# Altium schematic sheet LCDTFT_FPC40P_RGB_FULL.SchDoc: =DocumentName
size A3; DocumentNumber: 11; SheetNumber: 6; SheetTotal: 8
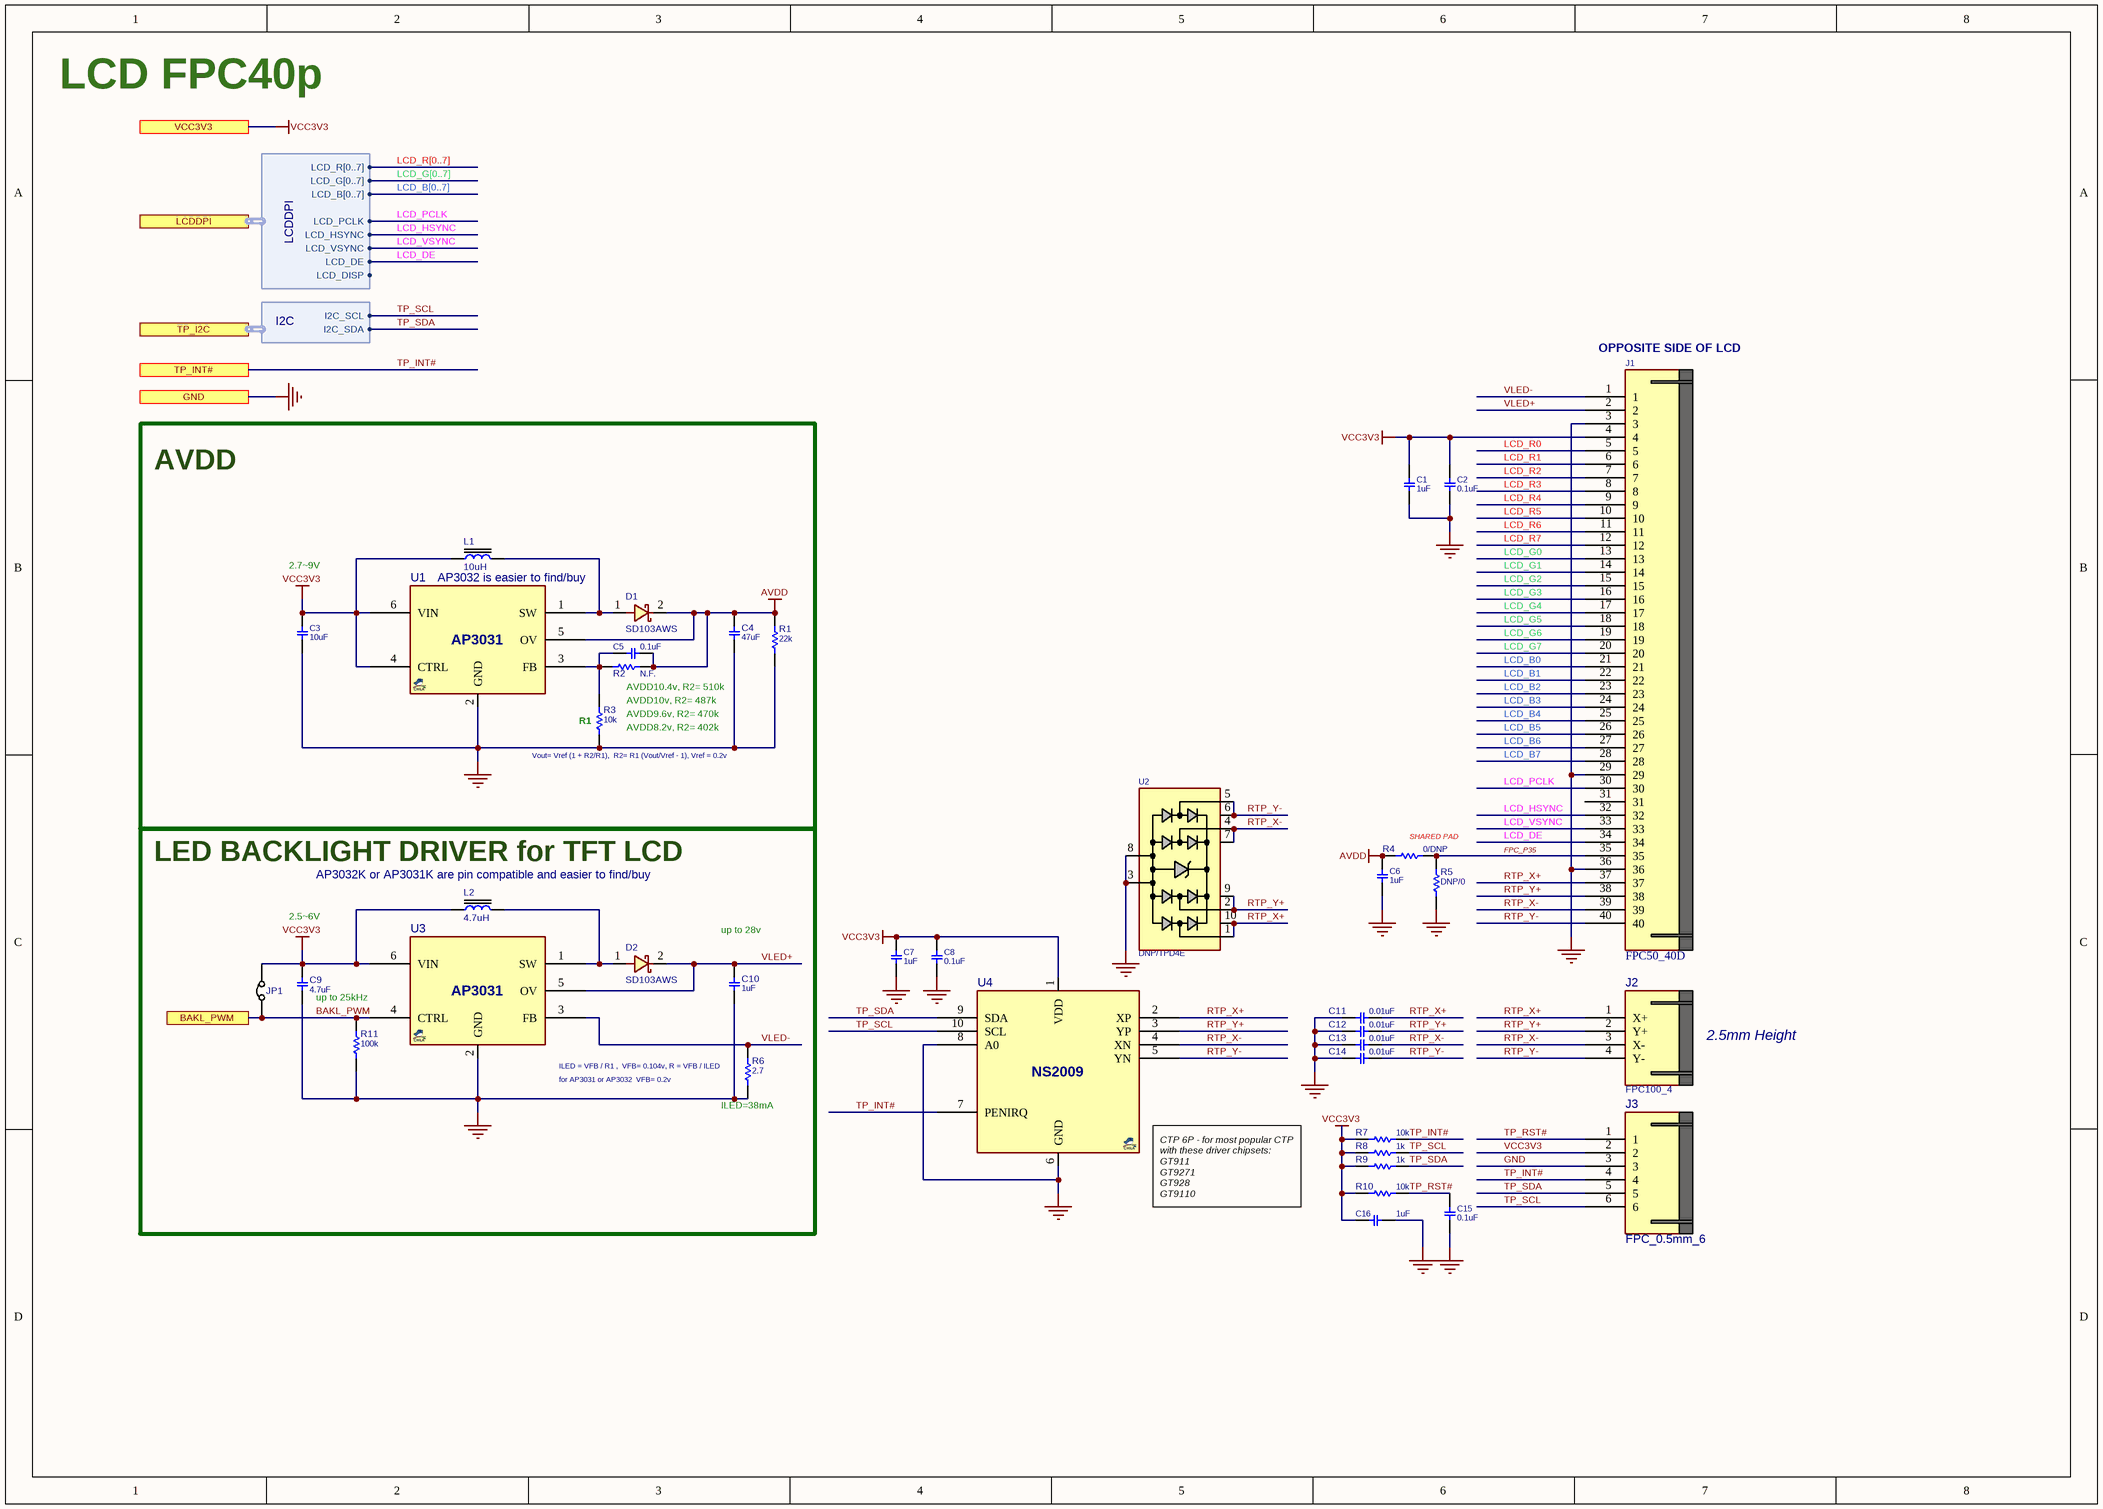
[diagram p0: LCDTFT_FPC40P_RGB_FULL.SchDoc]

## Parts
C1  1uF  [C0402]
C2  0.1uF  [C0402]
C3  10uF  [C0402]
C4  47uF  [C1206]
C5  0.1uF  [C0402]
C6  1uF  [C0402]
C7  1uF  [C0402]
C8  0.1uF  [C0402]
C9  4.7uF  [C0402]
C10  1uF  [C0603]
C11  0.01uF  [C0402]
C12  0.01uF  [C0402]
C13  0.01uF  [C0402]
C14  0.01uF  [C0402]
C15  0.1uF  [C0402]
C16  1uF  [C0402]
D1  SD103AWS  [D_SOD323]
D2  SD103AWS  [D_SOD323]
J1  FPC50_40D  [FPC50_40D_FFC2B29]
J2  FPC100_4  [FPC100_4HT]
J3  FPC_0.5mm_6  [FPC50_6]
JP1  JMPSOLDER  [JP_60X100]  (value not drawn)  (no BOM)
L1  10uH  [L_4]
L2  4.7uH  [L1008]
R1  22k  [R0402]
R2  N.F.  [R0402]
R3  10k  [R0402]
R4  0/DNP  [R0402]
R5  DNP/0  [R0402]
R6  2.7  [R0402]
R7  10k  [R0402]
R8  1k  [R0402]
R9  1k  [R0402]
R10  10k  [R0402]
R11  100k  [R0402]
U1  AP3031  [SOT23_6]  (value not drawn)
U2  DNP/TPD4E  [SON50_10_2510E]
U3  AP3031  [SOT23_6]  (value not drawn)
U4  NS2009  [SOG50_10]  (value not drawn)

## Blocks framed on the sheet
AVDD: C3-C5 D1 L1 R1-R3 U1
LED BACKLIGHT DRIVER for TFT LCD: C9 C10 D2 JP1 L2 R6 R11 U3

## Ports
BAKL_PWM, GND, LCDDPI (harness LCDDPI), TP_I2C (harness I2C), TP_INT#, VCC3V3

## Harnesses
LCDDPI: LCD_PCLK, LCD_HSYNC, LCD_VSYNC, LCD_DE, LCD_R[0..7], LCD_G[0..7], LCD_B[0..7], LCD_DISP
I2C: I2C_SCL, I2C_SDA

## Nets
AVDD: C4.2 C5.1 C6.2 D1.2 R1.1 R2.2 R4.1 U1.5(OV)
GND: C1.2 C2.2 C3.1 C4.1 C6.1 C7.2 C8.1 C9.2 C10.1 C11.2 C12.2 C13.2 C14.2 C15.2 C16.2 J1.3 J1.29 J1.36 J3.3 R1.2 R3.2 R5.2 R6.2 R11.2 U1.2(GND) U2.3 U2.8 U3.2(GND) U4.6(GND) U4.8(A0) ; port GND
VCC3V3: C1.1 C2.1 C3.2 C7.1 C8.2 C9.1 C16.1 J1.4 J3.2 JP1.2 L1.1 L2.1 R7.1 R8.1 R9.1 R10.1 U1.4(CTRL) U1.6(VIN) U3.6(VIN) U4.1(VDD) ; port VCC3V3
BAKL_PWM: JP1.1 R11.1 U3.4(CTRL) ; port BAKL_PWM
FPC_P35: J1.35 R4.2 R5.1
LCD_B0: J1.21
LCD_B1: J1.22
LCD_B2: J1.23
LCD_B3: J1.24
LCD_B4: J1.25
LCD_B5: J1.26
LCD_B6: J1.27
LCD_B7: J1.28
LCD_DE: J1.34 ; port LCDDPI.LCD_DE
LCD_G0: J1.13
LCD_G1: J1.14
LCD_G2: J1.15
LCD_G3: J1.16
LCD_G4: J1.17
LCD_G5: J1.18
LCD_G6: J1.19
LCD_G7: J1.20
LCD_HSYNC: J1.32 ; port LCDDPI.LCD_HSYNC
LCD_PCLK: J1.30 ; port LCDDPI.LCD_PCLK
LCD_R0: J1.5
LCD_R1: J1.6
LCD_R2: J1.7
LCD_R3: J1.8
LCD_R4: J1.9
LCD_R5: J1.10
LCD_R6: J1.11
LCD_R7: J1.12
LCD_VSYNC: J1.33 ; port LCDDPI.LCD_VSYNC
RTP_X+: C11.1 J1.37 J2.1(X+) U2.1 U2.10 U4.2(XP)
RTP_X-: C13.1 J1.39 J2.3(X-) U2.4 U2.7 U4.4(XN)
RTP_Y+: C12.1 J1.38 J2.2(Y+) U2.2 U2.9 U4.3(YP)
RTP_Y-: C14.1 J1.40 J2.4(Y-) U2.5 U2.6 U4.5(YN)
TP_INT#: J3.4 R7.2 U4.7(PENIRQ) ; port TP_INT#
TP_RST#: C15.1 J3.1 R10.2
TP_SCL: J3.6 R8.2 U4.10(SCL) ; port TP_I2C.I2C_SCL
TP_SDA: J3.5 R9.2 U4.9(SDA) ; port TP_I2C.I2C_SDA
VLED+: C10.2 D2.2 J1.2 U3.5(OV)
VLED-: J1.1 R6.1 U3.3(FB)
NetC5_2: C5.2 R2.1 R3.1 U1.3(FB)
NetD1_1: D1.1 L1.2 U1.1(SW)
NetD2_1: D2.1 L2.2 U3.1(SW)

Not connected (* = marked no-connect by the designer): J1 31

## Buses and harness runs
bus LCD_B[0..7]
bus LCD_G[0..7]
bus LCD_R[0..7]

## Notes on the sheet
- LCD FPC40p
- (near J1) OPPOSITE SIDE OF LCD
- 2.7~9V
- (near L1) AP3032 is easier to find/buy
- (near R3) R1
- (near R2) AVDD10.4v, R2= 510k
- AVDD10v, R2= 487k
- AVDD9.6v, R2= 470k
- (near R3) Vout= Vref (1 + R2/R1),  R2= R1 (Vout/Vref - 1), Vref = 0.2v
- (near R3) AVDD8.2v, R2= 402k
- (near R4) SHARED PAD
- 2.5~6V
- (near L2) AP3032K or AP3031K are pin compatible and easier to find/buy
- (near C10) up to 28v
- (near C9) up to 25kHz
- 2.5mm Height
- ILED = VFB / R1 ,  VFB= 0.104v, R = VFB / ILED
- (near U3) for AP3031 or AP3032  VFB= 0.2v
- (near R6) ILED=38mA
- (near U4) CTP 6P - for most popular CTP
  with these driver chipsets:
  GT911
  GT9271
  GT928
  GT9110
- Title:
- Project:
- Sheet:
- Revision:
- of
- Engineer:
- Approved By:
- File:

## Library data of the parts
C1 C6 C16 = CAP_SMD_MLCC: CAP, MLCC; PARAM: X5R, 10%; MANF_P#: CL05A105KO5NNND; MANF: Samsung; PARAM2: 16v; PRICE: 50,000:	$0.006; ASSEMBLY: ASSEMBLY; VALUE: 1uF
C2 C8 C15 = CAP_SMD_MLCC: CAP, MLCC; PARAM: X7R, 10%, -55~125oC; MANF_P#: GRM155R71H104KE14D; MANF: Murata; PARAM2: 50v; PRICE: 100: 0.018$; ASSEMBLY: ASSEMBLY; VALUE: 0.1uF
C3 = CAP_SMD_MLCC: CAP, MLCC; PARAM: X5R, 20%; MANF_P#: CL05A106MP5NUNC; MANF: Samsung; PARAM2: 10v; PRICE: 10,000: $0.034; ASSEMBLY: ASSEMBLY; VALUE: 10uF
C4 = CAP_SMD_MLCC: CAP, MLCC; PARAM: X5R, 10%; MANF_P#: GRM31CR61E476ME44L; MANF: Murata; PARAM2: 25v; PRICE: 100:	$0.27; ASSEMBLY: ASSEMBLY; VALUE: 47uF
C5 = CAP_SMD_MLCC_100n50V: CAP, MLCC, 100nF, 50V, X7R, 10%, 0402C; MANF: Murata; MANF_P#: GCM155R71H104KE02D; PARAM: 50V; DESC: CAP, MLCC, 100nF, 50V, X7R, 10%, 0402C; PARAM2: X7R, 10%; ASSEMBLY: ASSEMBLY; PRICE: 100= 1.3$; VALUE: 0.1uF
C7 = CAP_SMD_MLCC: CAP, MLCC; PARAM: X5R, 10%; MANF_P#: GMK105ABJ105KV-F; MANF: Taiyo Yuden; PARAM2: 35v; PRICE: 100: 0.06$; ASSEMBLY: ASSEMBLY; VALUE: 1uF
C9 = CAP_SMD_MLCC: CAP, MLCC; PARAM: X5R, 20%; MANF_P#: LMK105BBJ475MVLF; MANF: Taiyo Yuden; PARAM2: 10v; PRICE: 10,000: $0.034; ASSEMBLY: ASSEMBLY; VALUE: 4.7uF
C10 = CAP_SMD_MLCC: CAP, MLCC; PARAM: X5R, 10%; MANF_P#: CL10A105KB8NNNC; MANF: Samsung; PARAM2: 50v; PRICE: 50,000:	$0.006; ASSEMBLY: ASSEMBLY; VALUE: 1uF
C11-C14 = CAP_SMD_MLCC: CAP, MLCC; PARAM: X5R, 10%; PARAM2: 50v; PRICE: 50,000:	$0.006; MANF_P#: -; MANF: -; ASSEMBLY: ASSEMBLY; VALUE: 0.01uF
D1 D2 = DIODE_SMD_SCHOTTKY_1N5819: DIODE, SCHOTTKY, 40V, 2A; MANF: DIODES; DESC: DESCRIPTION; MANF_P#: SD103AWS; ASSEMBLY: ASSEMBLY; PRICE: PRICE; PARAM2: 2A; PARAM: 40V; VALUE: SD103AWS
J1 = FPC50_40D_FFC2B29: CONN, FPC, 0.50mm pitch, RightAngle, Dual side Contact; MANF: GCT; MANF_P#: FFC2B29-40-G; VALUE: FPC50_40D
J2 = LCD_RTP_FPC4P: LCD Resistive touch, FPC 4pin; MANF: -; MANF_P#: -; PARAM: -; VALUE: FPC100_4
J3 = FPC50_6: CONN, FPC, 0.50mm pitch, RightAngle, Bot. Contact, Hinge type; MANF: FCI; MANF_P#: SFV6R1STBE1HLF; VALUE: FPC_0.5mm_6
JP1 = JUMPER_SOLDER: JUMPER, HEADER 2PIN; MANF: MANF; MANF_P#: MANF_P#; VALUE: JMPSOLDER
L1 = INDPWR_SMD: INDUCTOR, POWER, SMD; MANF_P#: GCD43-100MC; VALUE: 10uH
L2 = INDPWR_SMD: INDUCTOR, POWER, SMD; MANF_P#: TMS252012ALM-4R7MTAA; PARAM: 1.5A, 200mOhm DCR; VALUE: 4.7uH
R1-R3 R6 R11 = RES_SMD: RESISTOR, SMD, 20K, 0402; MANF: Yageo; PARAM: 0.063W; DIST#: MOUSER; PARAM2: 1%; MANF_P#: RK73H1ETTP2002F; ASSEMBLY: ASSEMBLY; PRICE: 100= 0.5$; DESC: RESISTOR, SMD, 20K, 0402
  R1: VALUE: 22k
  R2: VALUE: N.F.
  R3: VALUE: 10k
  R6: VALUE: 2.7
  R11: VALUE: 100k
R4 R5 R7-R10 = RES_SMD: RESISTOR, SMD; PARAM: 0.063W; DESC: DESCRIPTION; DIST#: MOUSER; PARAM2: 1%; MANF_P#: -; MANF: -; ASSEMBLY: ASSEMBLY; PRICE: 100= 0.3$
  R4: VALUE: 0/DNP
  R5: VALUE: DNP/0
  R7 R10: VALUE: 10k
  R8 R9: VALUE: 1k
U1 U3 = VREG_AP3031_SOT23: REG, Switching, Boost, 1.4A, ADJ, 1MHz, SOT-23-6; PARAM: 1.4A, 1MHz, -40~85oC; PARAM2: 2.7~16VIN; MANF_P#: AP3031K; MANF: Diodes; PRICE: 0.1$; VALUE: AP3031
U2 = TVS_X4_TPD4E05U06: TVS, ESD PROTECT, 4CH,; MANF_P#: TPD4E05U06DQA; MANF: Texas Instruments; PARAM2: 6.5Vbr, 0.4pF, –40°~125°C; PARAM: ±12-kV ContactD, ±15-kVAirD; PRICE: 0.6$; VALUE: DNP/TPD4E
U4 = NS2009_MSOP10: LCD, Touch Screen Controller, 12Bit, I2C, MSOP-10; MANF: NSWAY; PARAM2: 2~5.5V; PARAM: I²C, 12Bit, -40~85℃; MANF_P#: NS2009; PRICE: 1.5$; VALUE: NS2009